# Altium schematic sheet MCU.SchDoc
size A4; SheetNumber: 8; SheetTotal: 9
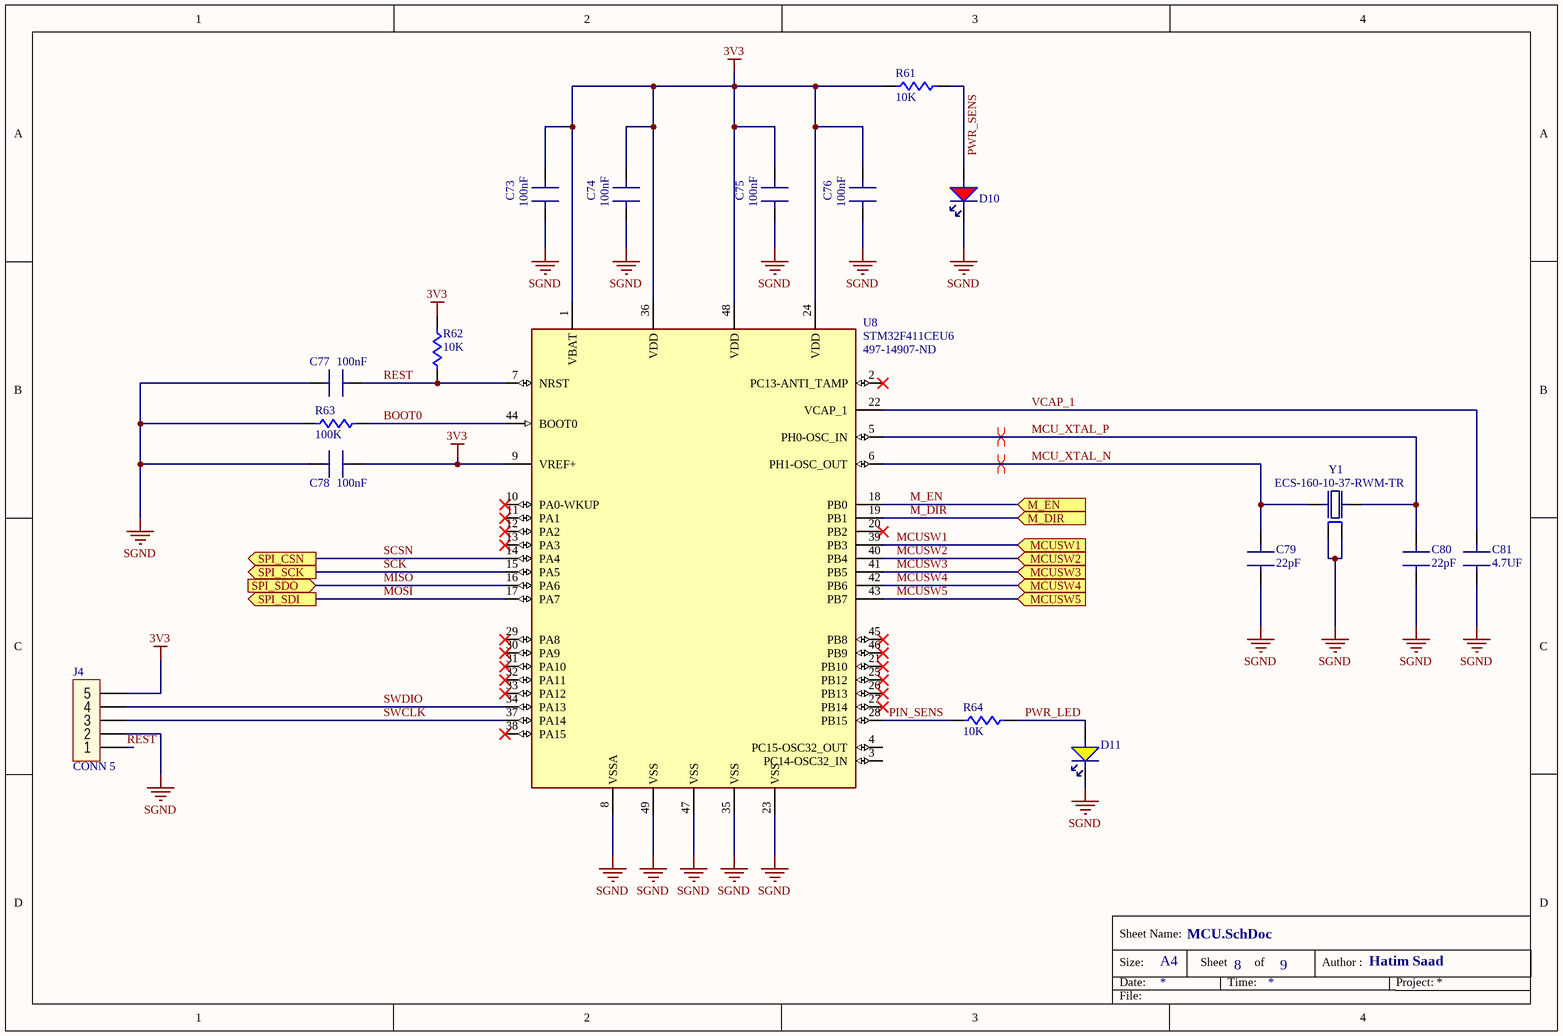
[diagram p0: MCU.SchDoc]

## Parts
C73  100nF  [CAP: 0603]
C74  100nF  [CAP: 0603]
C75  100nF  [CAP: 0603]
C76  100nF  [CAP: 0603]
C77  100nF  [CAP: 0603]
C78  100nF  [CAP: 0603]
C79  22pF  [CAP: 0603]
C80  22pF  [CAP: 0603]
C81  4.7UF  [CAP: 0603]
D10  RED  [LED: 0603R]  (value not drawn)
D11  YELLOW  [LED: 0603Y]  (value not drawn)
J4  CONN 5  [CON: PLS-5]
R61  10K  [RES: 0603]
R62  10K  [RES: 0603]
R63  100K  [RES: 0603]
R64  10K  [RES: 0603]
U8  STM32F411CEU6  Supplier Part Number 1: 497-14907-ND  [STM32F411CEU6]
Y1  ECS-160-10-37-RWM-TR  [OSC: 2016]

## Ports
M_DIR (in), M_EN (in), MCUSW1 (in), MCUSW2 (in), MCUSW3 (in), MCUSW4 (in), MCUSW5 (in), SPI_CSN (out), SPI_SCK (out), SPI_SDI (out), SPI_SDO (in)

## Nets
3V3: C73.2(B) C74.2(B) C75.2(B) C76.2(B) C78.1(A) J4.5 R61.1 R62.1 U8.1(VBAT) U8.9(VREF+) U8.24(VDD) U8.36(VDD) U8.48(VDD)
SGND: C73.1(A) C74.1(A) C75.1(A) C76.1(A) C77.2(B) C78.2(B) C79.2(B) C80.2(B) C81.2(B) D10.1(C) D11.1(C) J4.2 R63.1 U8.8(VSSA) U8.23(VSS) U8.35(VSS) U8.47(VSS) U8.49(VSS) Y1.2(GND) Y1.4(GND)
BOOT0: R63.2 U8.44(BOOT0)
M_DIR: U8.19(PB1) ; port M_DIR
M_EN: U8.18(PB0) ; port M_EN
MCU_XTAL_N: C79.1(A) U8.6(PH1-OSC_OUT) Y1.3(XTAL2)
MCU_XTAL_P: C80.1(A) U8.5(PH0-OSC_IN) Y1.1(XTAL1)
MCUSW1: U8.39(PB3) ; port MCUSW1
MCUSW2: U8.40(PB4) ; port MCUSW2
MCUSW3: U8.41(PB5) ; port MCUSW3
MCUSW4: U8.42(PB6) ; port MCUSW4
MCUSW5: U8.43(PB7) ; port MCUSW5
MISO: U8.16(PA6) ; port SPI_SDO
MOSI: U8.17(PA7) ; port SPI_SDI
PIN_SENS: R64.2 U8.28(PB15)
PWR_LED: D11.2(A) R64.1
PWR_SENS: D10.2(A) R61.2
REST: C77.1(A) J4.1 R62.2 U8.7(NRST)
SCK: U8.15(PA5) ; port SPI_SCK
SCSN: U8.14(PA4) ; port SPI_CSN
SWCLK: J4.3 U8.37(PA14)
SWDIO: J4.4 U8.34(PA13)
VCAP_1: C81.1(A) U8.22(VCAP_1)

Not connected (* = marked no-connect by the designer): U8 2(PC13-ANTI_TAMP)* 3(PC14-OSC32_IN) 4(PC15-OSC32_OUT) 10(PA0-WKUP)* 11(PA1)* 12(PA2)* 13(PA3)* 20(PB2)* 21(PB10)* 25(PB12)* 26(PB13)* 27(PB14)* 29(PA8)* 30(PA9)* 31(PA10)* 32(PA11)* 33(PA12)* 38(PA15)* 45(PB8)* 46(PB9)*

## Layout directives
differential pair: MCU_XTAL_N, MCU_XTAL_P

## Notes on the sheet
- Size:
- Date:
- Sheet Name:
- A4
- Sheet
- Time:
- of
- Author :
- Hatim Saad
- Project:
- File:

## Library data of the parts
C73-C81 = CAP 0603: CAP SMD 0603
D10 = LED RED 0603: LED RED CLEAR 0603 SMD
D11 = LED YELLOW 0603: LED YELLOW CLEAR 0603 SMD
R61-R64 = RES 0603: RES SMD 0603
U8 = STM32F411CEU6: IC MCU 32BIT 512KB FLSH 48UFQFPN; Manufacturer: STMicroelectronics; Interface: I2C,SPI,USB,IrDA,MMC,SDIO,SD,UART,USART,LIN,I2S; Number of I/Os: 36; Frequency: 100MHz; Oscillator Type: Internal; Memory Type: FLASH; Peripherals: Brown-out Detect/Reset,POR,PWM,WDT,DMA; Core Architecture: ARM; RAM Size: 128KB; Max Power Dissipation: 625mW; Number of Timers/Counters: 8; Min Supply Voltage: 1.7V; Max Supply Voltage: 3.6V; Data Bus Width: 32b; Watchdog Timer: Yes; Number of ADC Channels: 16; Operating Supply Voltage: 3.3V; Supplier 1: Digi-Key; Manufacturer Part Number: STM32F411CEU6; Mount: Surface Mount; Case/Package: UFQFPN; Number of Pins: 48; Min Operating Temperature: -40°C; Max Operating Temperature: 85°C; Packaging: Tray; Memory Size: 512KB; Number of Programmable I/O: 36; Max Frequency: 100MHz; Package Quantity: 1560; Length: 7mm; Width: 7mm; Radiation Hardening: No; Lead Free: Lead Free; RoHS Compliant: Yes; REACH SVHC: No SVHC
Y1 = XC2119DKR-ND: CRYSTAL 16.0000MHZ 10PF SMD; Supplier 1: Mouser; Supplier Part Number 1: 520-160-10-37-RWM-T